# Altium schematic sheet top.SchDoc: schematic template
size 420 x 297 mm; Date: 2021-12-08; Author: Joachim Löfwander; Revision: ABC-123; SheetNumber: 1; SheetTotal: 4; Website: jlofw.com
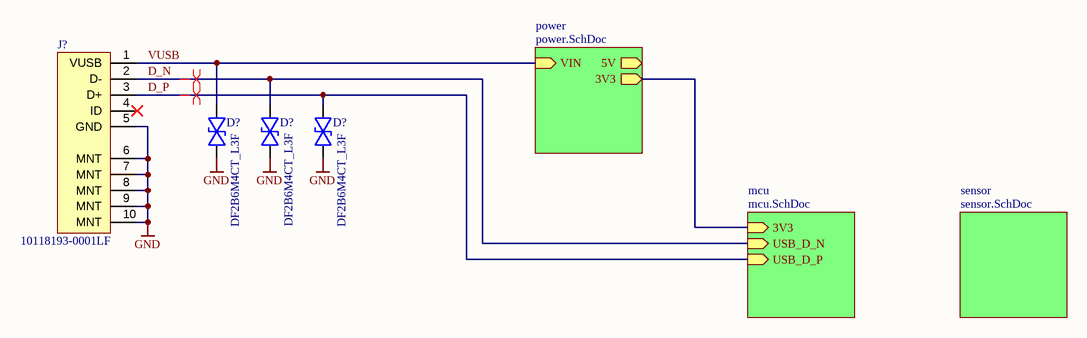
[diagram p0: top.SchDoc]

## Parts
(Parts that share a designator on the sheet are numbered #1, #2 ... from top to bottom, then left to right.)
D?#1  Manufacturer P/N: DF2B6M4CT_L3F  [D_SOD-882]  (hidden comment: Diode_TVS_Bi)
D?#2  Manufacturer P/N: DF2B6M4CT_L3F  [D_SOD-882]  (hidden comment: Diode_TVS_Bi)
D?#3  Manufacturer P/N: DF2B6M4CT_L3F  [D_SOD-882]  (hidden comment: Diode_TVS_Bi)
J?  Manufacturer P/N: 10118193-0001LF  [Amphenol_10118193-0001LF_Micro_USB]  (hidden comment: Amphenol_10118193-0001LF_Micro_USB)

## Sub-sheets
mcu = mcu.SchDoc: 3V3 (in), USB_D_P (in), USB_D_N (in)
power = power.SchDoc: VIN (in), 3V3 (out), 5V (out)
sensor = sensor.SchDoc: no entries

## Nets
GND: D?#1.2(A) D?#2.2(A) D?#3.2(A) J?.5(GND) J?.6(MNT) J?.7(MNT) J?.8(MNT) J?.9(MNT) J?.10(MNT)
D_N: D?#2.1(C) J?.2(D-) ; sheet mcu/USB_D_N
D_P: D?#3.1(C) J?.3(D+) ; sheet mcu/USB_D_P
VUSB: D?#1.1(C) J?.1(VUSB) ; sheet power/VIN
(unnamed): sheet power/3V3, sheet mcu/3V3

Not connected (* = marked no-connect by the designer): J? 4(ID)*

## Layout directives
differential pair: D_N, D_P

## Notes on the sheet
- PROJECT
- TITLE
- FILE NAME
- DATE MODIFIED
- SHEET
- REV
- OF
- AUTHOR
- WEBSITE

## Library data of the parts
D?#1-D?#3 = 40005: TVS DIODE 5.5VWM 15VC; Manufacturer: Toshiba; Internal Number: 40005; Package: SOD-882
J? = 110003: Micro USB B SMD Horisontal; Manufacturer: Amphenol ICC / FCI; Internal Number: 110003